# EAGLE design H3_HMI_PulsadorSmall_A_Rev_1 (EAGLE 7.6.0)
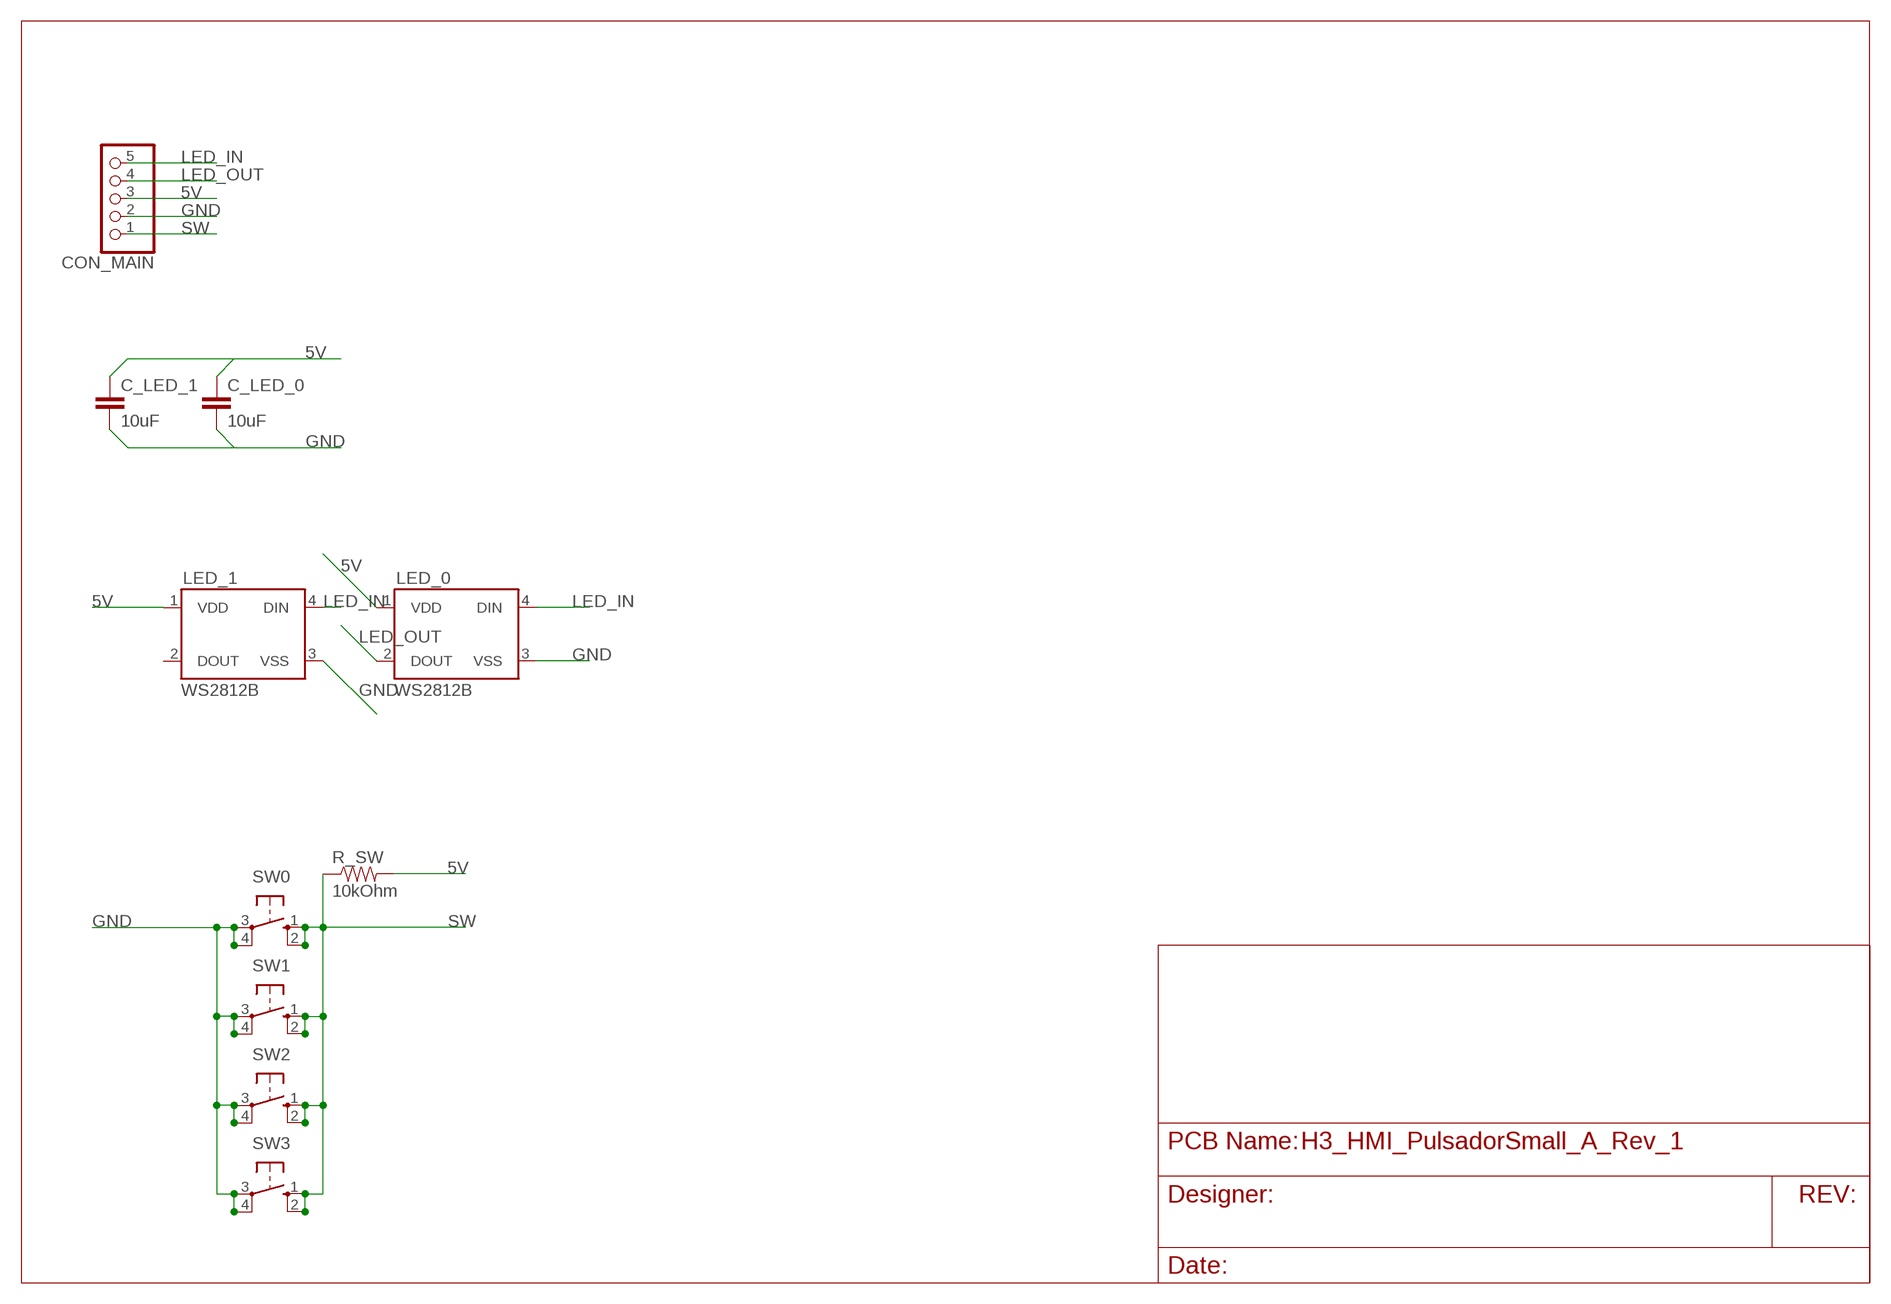
[diagram p0: schematic, sheet 1]

## Parts
C_LED_0  10uF  C-EUC1206  [C1206]
C_LED_1  10uF  C-EUC1206  [C1206]
CON_MAIN  PINHD-1X5/90  [1X05/90]
LED_0  WS2812B  [WS2812B]
LED_1  WS2812B  [WS2812B]
R_SW  10kOhm  RESISTOR1206  [1206]
SW0  10-XX  [B3F-10XX]
SW1  10-XX  [B3F-10XX]
SW2  10-XX  [B3F-10XX]
SW3  10-XX  [B3F-10XX]

## Nets
5V: C_LED_0.1 C_LED_1.1 CON_MAIN.3 LED_0.1(VDD) LED_1.1(VDD) R_SW.2
GND: C_LED_0.2 C_LED_1.2 CON_MAIN.2 LED_0.3(VSS) LED_1.3(VSS) SW0.3(P) SW0.4(P1) SW1.3(P) SW1.4(P1) SW2.3(P) SW2.4(P1) SW3.3(P) SW3.4(P1)
LED_IN: CON_MAIN.5 LED_0.4(DIN) LED_1.4(DIN)
LED_OUT: CON_MAIN.4 LED_0.2(DOUT)
SW: CON_MAIN.1 R_SW.1 SW0.1(S) SW0.2(S1) SW1.1(S) SW1.2(S1) SW2.1(S) SW2.2(S1) SW3.1(S) SW3.2(S1)
Unconnected: LED_1.2(DOUT)

## Library data of the parts
C_LED_0 C_LED_1 = resistor:C-EU: CAPACITOR, European symbol
CON_MAIN = pinhead:PINHD-1X5: PIN HEADER
LED_0 LED_1 = SparkFun-LED:WS2812B: WS2812B - Intelligent control LED integrated light source Technical Specifications: Power Supply Voltage (VDD): 3.5 to 5.3 V Input Voltage (VI): -0.5 to VDD+0.5 V Operating Junction Temperature (Topt): -25°C to +80°C Storage Temperature Range (Tstg): -55°C to +150°C; PROD_ID: DIO-12503
R_SW = SparkFun-Passives:RESISTOR: Resistor Basic schematic elements and footprints for 0603, 1206, and PTH resistors.
SW0 SW1-SW3 = switch-omron:10-XX: OMRON SWITCH; MPN: B3F-1000; OC_FARNELL: 176432; OC_NEWARK: 36M3542

## Board
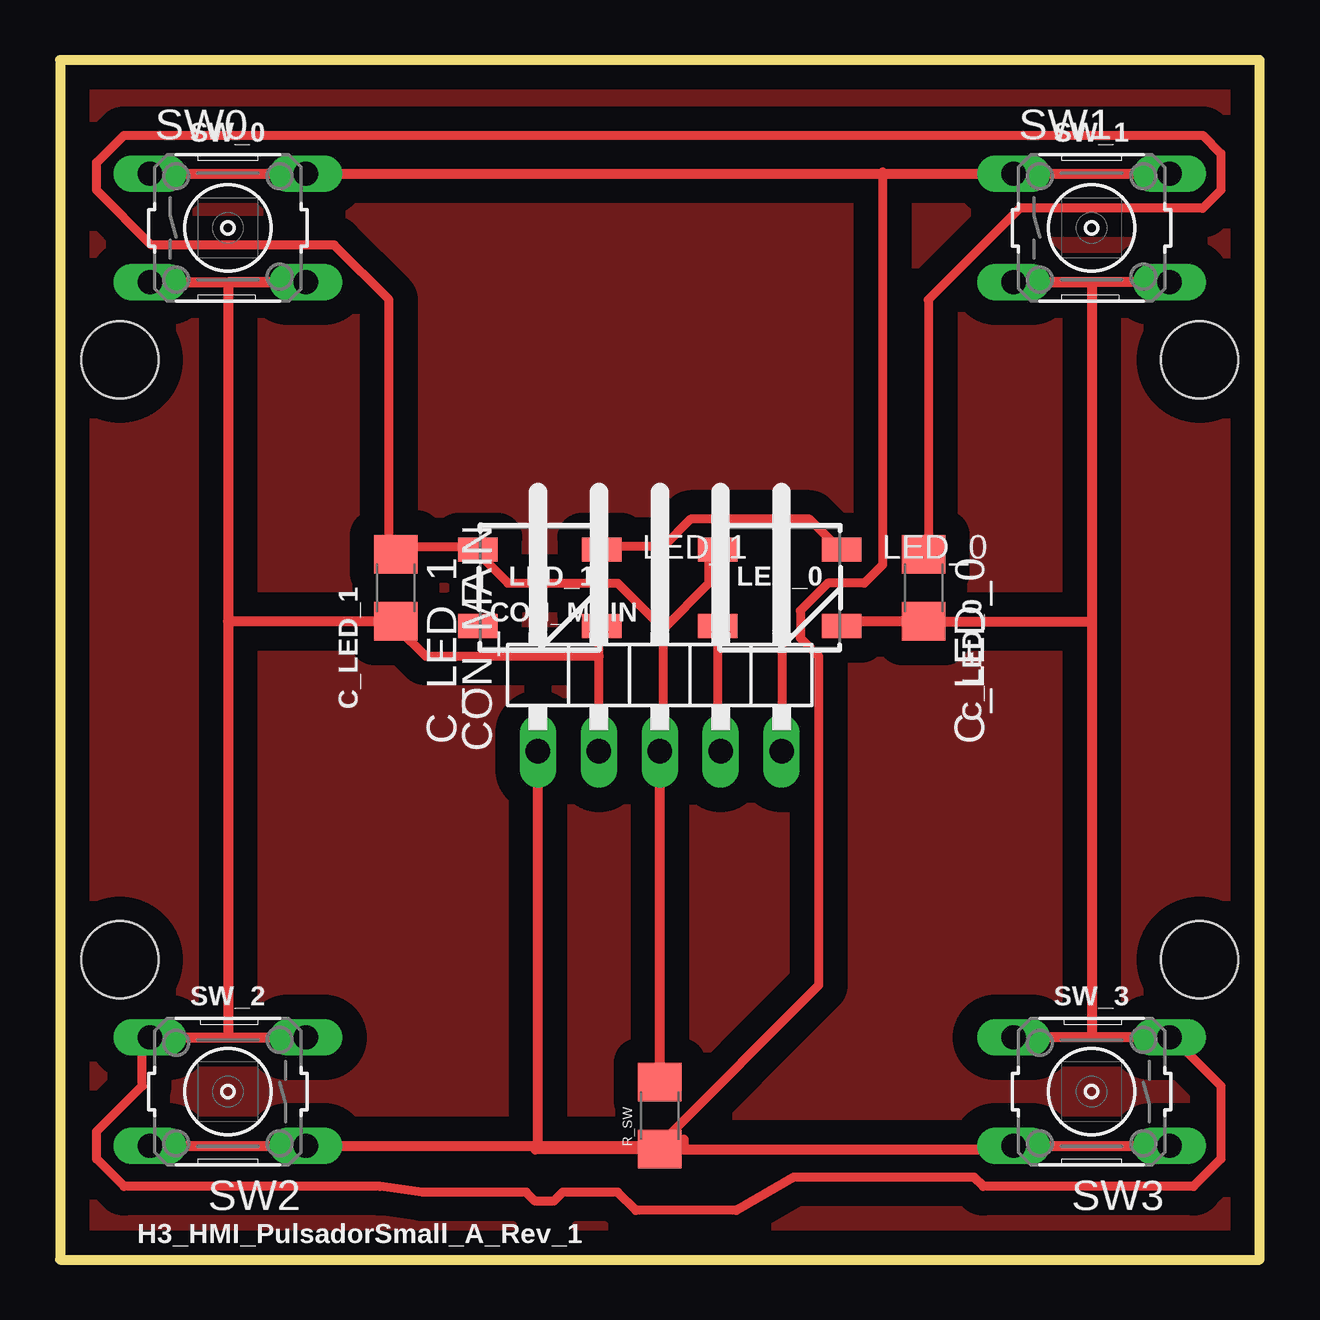
[diagram p1: board, top side]

Size 50 x 50 mm. Coordinates in mm from the lower left corner, seen from the top.
Outline: 0,0 50,0 50,50 0,50 0,0
Copper layers (1*16): Top 0.035mm / dielectric 1.5mm / Bottom 0.035mm
Design rules "default *": minimum track width 15mil, minimum drill 24mil, track to track 15mil, track to pad 15mil, pad to pad 15mil, via to via 10mil, smd to smd 8mil, copper to edge 40mil, drill to drill 8mil, minimum pad ring 10mil, minimum via ring 8mil, stop-mask expansion 4mil, vias tented up to drill 0mil, thermal gap 10mil
Holes 3.2 mm at 2.5,37.5 47.5,37.5 47.5,12.5 2.5,12.5

### Footprints (pad centres in the part's own frame; a part is rotated, then mirrored left to right if it is on the bottom)
C1206 = smd 1.6 x 1.8: 1 -1.4,0; 2 1.4,0
1X05/90 = drill 1.016 long: 1 -5.08,-3.81; 2 -2.54,-3.81; 3 0,-3.81; 4 2.54,-3.81; 5 5.08,-3.81
WS2812B = smd 1.651 x 1: 1 -2.577,1.6; 2 -2.577,-1.6; 3 2.577,-1.6; 4 2.577,1.6
1206 = smd 1.6 x 1.8: 1 -1.4,0; 2 1.4,0
B3F-10XX = drill 1.016 long: 1 -3.251,2.261; 2 3.251,2.261; 3 -3.251,-2.261; 4 3.251,-2.261

### Placement (x,y rotation side)
C_LED_0  36,28 270 top
C_LED_1  14,28 270 top
CON_MAIN  25,25 0 top
LED_0  30,28 0 top
LED_1  20,28 0 top
R_SW  25,6 90 top
SW0  7,43 0 top
SW1  43,43 0 top
SW2  7,7 180 top
SW3  43,7 180 top

### Tracks (layer width: path | path; a pad name or v marks a point on that pad's centre or on a via)
5V
  Top 0.381: 25.15,26.29 27.05,28.19 27.05,29.34 LED_0.1 | 25.15,26.29 25.15,21.34 CON_MAIN.3 | C_LED_0.1 36.2,29.72 36.2,40.01 40.01,43.81 47.62,43.81 48.39,44.58 48.39,46.1 47.62,46.86 2.67,46.86 1.52,45.72 1.52,44.58 3.81,42.29 11.43,42.29 13.72,40.01 13.72,29.72 C_LED_1.1 14.1,29.72 17.14,29.72 LED_1.1 17.53,29.34 18.67,28.19 23.24,28.19 25.15,26.29
  Top 0.406: R_SW.2 CON_MAIN.3
GND
  Top 0.381: 22.48,25.15 22.48,21.34 CON_MAIN.2 | 22.48,25.15 22.48,26.29 LED_1.3 | 22.48,25.15 15.24,25.15 14.1,26.29 C_LED_1.2 | SW2.4 3.43,9.14 3.43,7.24 1.52,5.33 1.52,4.19 2.67,3.05 13.34,3.05 15.1,2.81 19.43,2.81 19.81,2.43 20.57,2.43 20.95,2.81 23.24,2.81 24,2.05 28.19,2.05 30.57,3.43 38.1,3.43 38.48,3.05 47.24,3.05 48.39,4.19 48.39,7.24 46.48,9.14 SW3.3
  Top 0.406: SW3.3 43,9.26 | 43,9.26 SW3.4 | SW2.4 7,9.26 | 7,9.26 SW2.3 | SW0.3 SW0.4 7,40.74 7,26.6 | SW1.4 SW1.3 43,40.74 43,26.6 | 43,26.6 43,9.26 | 7,26.6 7,9.26 | C_LED_1.2 7,26.6 | LED_0.3 32.58,26.6 C_LED_0.2 43,26.6
LED_IN
  Top 0.381: 30.1,30.86 31.24,30.86 32.38,29.72 LED_0.4 | 30.1,30.86 26.29,30.86 25.15,29.72 22.86,29.72 LED_1.4 | 30.1,30.86 30.1,21.34 CON_MAIN.5
LED_OUT
  Top 0.381: LED_0.2 27.43,26.29 27.43,21.34 CON_MAIN.4
N$1
  pour Top (isolate 1.016, rank 6): 0,50 50,50 50,0 0,0
SW
  Top 0.381: 19.81,4.74 19.81,4.57 19.92,4.6 | R_SW.1 25.15,4.95 31.62,11.43 31.62,25.15 30.86,25.91 30.86,27.05 32,28.19 33.53,28.19 34.29,28.96 34.29,45.26 34.29,45.34
  Top 0.406: SW0.1 SW0.2 34.29,45.26 SW1.1 SW1.2 | SW2.2 SW2.1 19.81,4.74 26,4.74 26,5 | SW3.1 SW3.2 39.75,4.6 R_SW.1 19.92,4.6 CON_MAIN.1

### Text on the board
tSilk: SW_0 | SW_1 | LED_1 | LED_0 | CON_MAIN | C_LED_1 | C_LED_0 | SW_2 | SW_3 | H3_HMI_PulsadorSmall_A_Rev_1